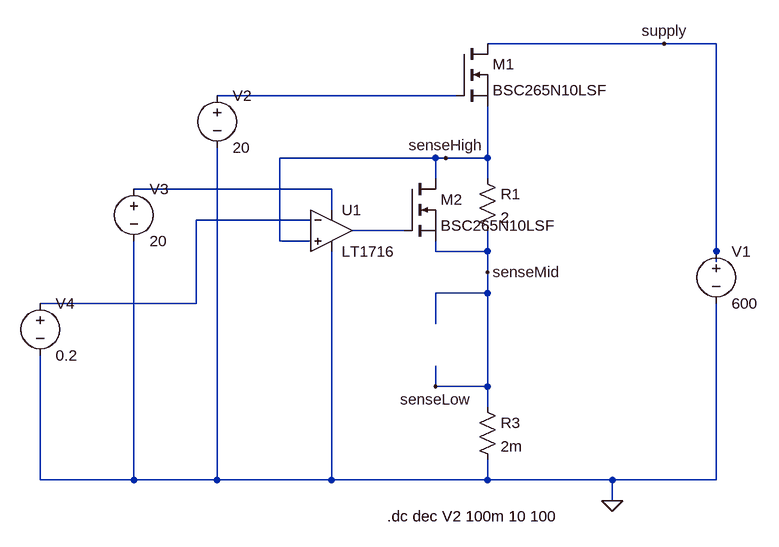
[diagram p0: schematic Shunts.asc]
Shunts.asc, the LTspice schematic file:
Version 4
SHEET 1 1568 680
WIRE 512 -288 240 -288
WIRE 592 -288 512 -288
WIRE 192 -208 -176 -208
WIRE 160 -112 -80 -112
WIRE 176 -112 160 -112
WIRE 240 -112 240 -192
WIRE 240 -112 176 -112
WIRE 160 -80 160 -112
WIRE 240 -80 240 -112
WIRE 0 -64 -304 -64
WIRE 0 -32 0 -64
WIRE -32 -16 -208 -16
WIRE 112 0 32 0
WIRE -80 16 -80 -112
WIRE -32 16 -80 16
WIRE 160 32 160 16
WIRE 240 32 240 0
WIRE 240 32 160 32
WIRE 592 32 592 -288
WIRE 592 48 592 32
WIRE 240 64 240 32
WIRE 240 96 240 64
WIRE 240 96 160 96
WIRE -208 112 -208 -16
WIRE -208 112 -448 112
WIRE 160 144 160 96
WIRE 160 240 160 208
WIRE 240 240 240 96
WIRE 240 240 160 240
WIRE 240 272 240 240
WIRE -448 384 -448 192
WIRE -304 384 -304 16
WIRE -304 384 -448 384
WIRE -176 384 -176 -128
WIRE -176 384 -304 384
WIRE 0 384 0 32
WIRE 0 384 -176 384
WIRE 240 384 240 352
WIRE 240 384 0 384
WIRE 432 384 240 384
WIRE 592 384 592 112
WIRE 592 384 432 384
WIRE 432 416 432 384
FLAG 512 -288 supply
FLAG 432 416 0
FLAG 160 240 senseLow
FLAG 176 -112 senseHigh
FLAG 240 64 senseMid
SYMBOL voltage 592 16 R0
WINDOW 123 0 0 Left 2
WINDOW 39 0 0 Left 2
SYMATTR InstName V1
SYMATTR Value 600
SYMBOL res 224 256 R0
SYMATTR InstName R3
SYMATTR Value 2m
SYMBOL nmos 192 -288 R0
SYMATTR InstName M1
SYMATTR Value BSC265N10LSF
SYMBOL voltage -176 -224 R0
WINDOW 123 0 0 Left 2
WINDOW 39 0 0 Left 2
SYMATTR InstName V2
SYMATTR Value 20
SYMBOL res 224 -96 R0
SYMATTR InstName R1
SYMATTR Value 2
SYMBOL nmos 112 -80 R0
SYMATTR InstName M2
SYMATTR Value BSC265N10LSF
SYMBOL Comparators\\LT1716 0 0 R0
SYMATTR InstName U1
SYMBOL voltage -304 -80 R0
WINDOW 123 0 0 Left 2
WINDOW 39 0 0 Left 2
SYMATTR InstName V3
SYMATTR Value 20
SYMBOL voltage -448 96 R0
WINDOW 123 0 0 Left 2
WINDOW 39 0 0 Left 2
SYMATTR InstName V4
SYMATTR Value 0.2
TEXT 86 440 Left 2 !.dc dec V2 100m 10 100

The netlist it stands for:
* Shunts.asc
V1 supply 0 600
R3 senseMid 0 2m
M1 supply N001 senseHigh senseHigh BSC265N10LSF
V2 N001 0 20
R1 senseHigh senseMid 2
M2 senseHigh N004 senseMid senseMid BSC265N10LSF
XU1 senseHigh N003 N002 0 N004 LT1716  ; pins In+ In- V+ V- OUT
V3 N002 0 20
V4 N003 0 0.2
.model NMOS NMOS
.model PMOS PMOS
.lib standard.mos
.dc dec V2 100m 10 100
.lib LTC1.lib
.backanno
.end